# Altium schematic sheet tiny_buck.SchDoc
size A3; SheetNumber: 5; SheetTotal: 5
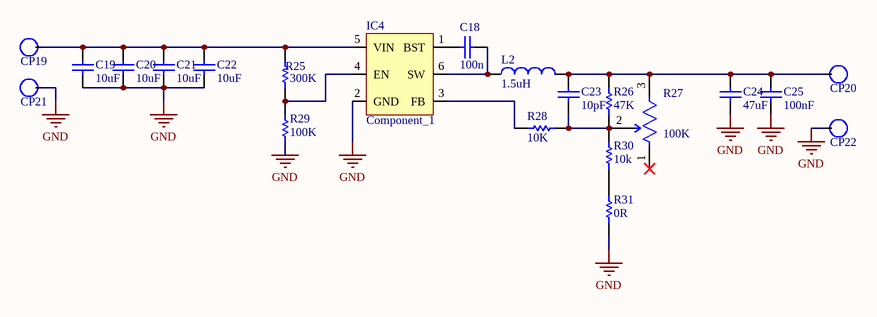
[diagram p0: tiny_buck.SchDoc]

## Parts
C18  value 100n  [SMD-0603-RES]  (hidden comment: Capacitor)
C19  value 10uF  [SMD-0603-RES]  (hidden comment: Capacitor)
C20  value 10uF  [SMD-0603-RES]  (hidden comment: Capacitor)
C21  value 10uF  [SMD-0603-RES]  (hidden comment: Capacitor)
C22  value 10uF  [SMD-0603-RES]  (hidden comment: Capacitor)
C23  value 10pF  [SMD-0603-RES]  (hidden comment: Capacitor)
C24  value 47uF  [SMD-0805-RES]  (hidden comment: Capacitor)
C25  value 100nF  [SMD-0603-RES]  (hidden comment: Capacitor)
CP19  CONNECT_PAD  [ROUND_SMALL]  (value not drawn)
CP20  CONNECT_PAD  [ROUND_SMALL]  (value not drawn)
CP21  CONNECT_PAD  [ROUND_SMALL]  (value not drawn)
CP22  CONNECT_PAD  [ROUND_SMALL]  (value not drawn)
IC4  Component_1  [SOT95P280X130-6N]
L2  value 1.5uH  [SMD-1206-RES]  (hidden comment: Cybermax CMLO252010F1R5MTT)
R25  value 300K  [SMD-0603-RES]  (hidden comment: Resistor)
R26  value 47K  [SMD-0603-RES]  (hidden comment: Resistor)
R27  Resistance: 100K  [FP-TC33X-2-MFG]  (hidden comment: TC33X-2-104E)
R28  value 10K  [SMD-0603-RES]  (hidden comment: Resistor)
R29  value 100K  [SMD-0603-RES]  (hidden comment: Resistor)
R30  value 10k  [SMD-0603-RES]  (hidden comment: Resistor)
R31  value 0R  [SMD-0603-RES]  (hidden comment: Resistor)

## Nets
GND: C19.1 C20.1 C21.1 C22.1 C24.1 C25.1 CP21.1 CP22.1 IC4.2(GND) R29.2 R31.1
NetC18_1: C18.1 IC4.6(SW) L2.1
NetC18_2: C18.2 IC4.1(BST)
NetC19_2: C19.2 C20.2 C21.2 C22.2 CP19.1 IC4.5(VIN) R25.2
NetC23_1: C23.1 R26.1 R27.2(WIPER) R28.1 R30.2
NetC23_2: C23.2 C24.2 C25.2 CP20.1 L2.2 R26.2 R27.3(CW)
NetIC4_3: IC4.3(FB) R28.2
NetIC4_4: IC4.4(EN) R25.1 R29.1
NetR30_1: R30.1 R31.2

Not connected (* = marked no-connect by the designer): R27 1(CCW)*

## Library data of the parts
C18-C25 = Capacitor: SimulationGenericComponent: True
L2 = Inductor: SimulationGenericComponent: True
R25 R26 R28-R31 = Resistor: TC1: 0; SimulationGenericComponent: True; TC2: 0
R27 = CMP-07234-000040-1: TRIMMER 100K OHM 0.1W J LEAD TOP; Number of Turns: 1; Voltage Rating (DC): 50V; Power Rating: 100mW; Resistance Tolerance: 25%; Temperature Coefficient: 250ppm/°C; Max Operating Temperature: 100°C; Package Quantity: 2500; REACH SVHC: No SVHC; Termination: Foot Print; Packaging: Tape and Reel; RoHS Compliant: Yes; Military Standard: Not; Color: Silver; Width: 0.118inch; Min Operating Temperature: -40°C; Mount: Surface Mount; Height: 0.047inch; Tolerance: 25%; Resistor Type: Carbon; Length: 3mm; Depth: 3.8mm; Weight: 29.4mg; Max Power Dissipation: 100mW; Series: TC33; Radiation Hardening: No